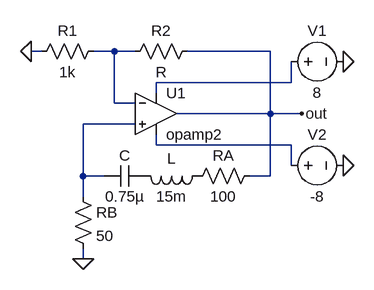
[diagram p0: schematic Draft1.asc]
Draft1.asc, the LTspice schematic file:
Version 4.1
SHEET 1 880 680
WIRE 32 -64 16 -64
WIRE 144 -64 112 -64
WIRE 176 -64 144 -64
WIRE 384 -64 256 -64
WIRE 416 -16 416 -48
WIRE 416 -16 208 -16
WIRE 208 0 208 -16
WIRE 144 16 144 -64
WIRE 176 16 144 16
WIRE 384 32 384 -64
WIRE 384 32 240 32
WIRE 432 32 384 32
WIRE 176 48 96 48
WIRE 208 80 208 64
WIRE 416 80 208 80
WIRE 416 112 416 80
WIRE 96 128 96 48
WIRE 128 128 96 128
WIRE 384 128 384 32
WIRE 384 128 352 128
WIRE 96 160 96 128
WIRE 96 256 96 240
FLAG 96 256 0
FLAG 432 32 out
FLAG 16 -64 0
FLAG 496 -48 0
FLAG 496 112 0
SYMBOL res 80 144 R0
SYMATTR InstName RB
SYMATTR Value 50
SYMBOL cap 192 112 R90
WINDOW 0 0 32 VBottom 2
WINDOW 3 32 32 VTop 2
SYMATTR InstName C
SYMATTR Value 0.75µ
SYMBOL ind 288 112 R90
WINDOW 0 5 56 VBottom 2
WINDOW 3 32 56 VTop 2
SYMATTR InstName L
SYMATTR Value 15m
SYMBOL res 368 112 R90
WINDOW 0 0 56 VBottom 2
WINDOW 3 32 56 VTop 2
SYMATTR InstName RA
SYMATTR Value 100
SYMBOL OpAmps\\opamp2 208 -32 R0
SYMATTR InstName U1
SYMBOL res 272 -80 R90
WINDOW 0 0 56 VBottom 2
WINDOW 3 32 56 VTop 2
SYMATTR InstName R2
SYMBOL res 128 -80 R90
WINDOW 0 0 56 VBottom 2
WINDOW 3 32 56 VTop 2
SYMATTR InstName R1
SYMATTR Value 1k
SYMBOL voltage 400 -48 R270
WINDOW 0 32 56 VTop 2
WINDOW 3 -32 56 VBottom 2
WINDOW 123 0 0 Left 0
WINDOW 39 0 0 Left 0
SYMATTR InstName V1
SYMATTR Value 8
SYMBOL voltage 400 112 R270
WINDOW 0 32 56 VTop 2
WINDOW 3 -32 56 VBottom 2
WINDOW 123 0 0 Left 0
WINDOW 39 0 0 Left 0
SYMATTR InstName V2
SYMATTR Value -8

The netlist it stands for:
* Draft1.asc
RB N003 0 50
C P001 N003 0.75µ
L P002 P001 15m
RA out P002 100
X§U1 N003 N001 N002 N004 out opamp2  ; pins In+ In- V+ V- OUT
R2 out N001 R
R1 N001 0 1k
V1 N002 0 8
V2 N004 0 -8
.backanno
.end